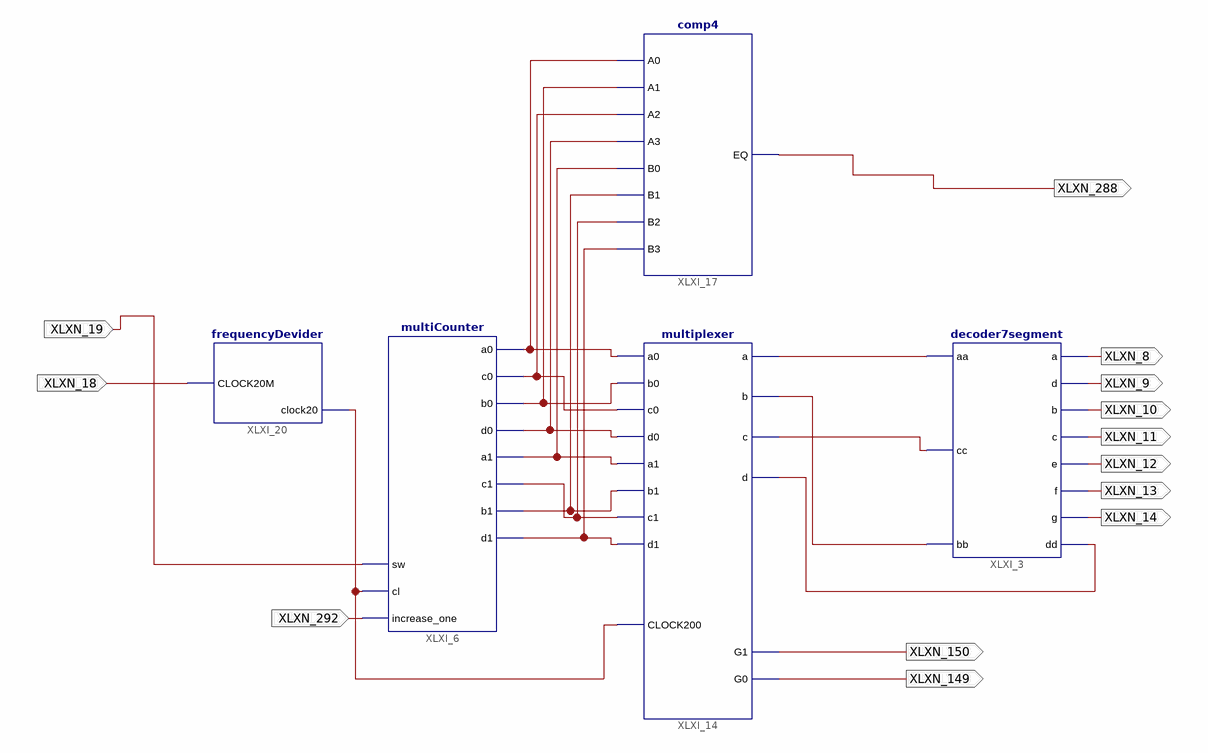
[diagram p0: schematic sheet 1]
// Xilinx ISE schematic testDividerAndCounterLED.sch (spartan6) as structural Verilog: 5 symbols, 13 ports
module testDividerAndCounterLED (
  input  XLXN_18,
  input  XLXN_19,
  input  XLXN_292,
  output XLXN_8,
  output XLXN_9,
  output XLXN_10,
  output XLXN_11,
  output XLXN_12,
  output XLXN_13,
  output XLXN_14,
  output XLXN_150,
  output XLXN_149,
  output XLXN_288
);

  wire COMMON1, XLXN_151, XLXN_152, XLXN_153, XLXN_154, XLXN_280, XLXN_281, XLXN_282, XLXN_283, XLXN_284,
       XLXN_285, XLXN_286, XLXN_287;

  decoder7segment XLXI_3 (
    .aa(XLXN_151), .cc(XLXN_153), .bb(XLXN_152), .a(XLXN_8), .d(XLXN_9), .b(XLXN_10), .c(XLXN_11),
    .e(XLXN_12), .f(XLXN_13), .g(XLXN_14), .dd(XLXN_154));
  multiplexer XLXI_14 (
    .a0(XLXN_280), .b0(XLXN_281), .c0(XLXN_282), .d0(XLXN_283), .a1(XLXN_284), .b1(XLXN_285), .c1(XLXN_286),
    .d1(XLXN_287), .CLOCK200(COMMON1), .a(XLXN_151), .b(XLXN_152), .c(XLXN_153), .d(XLXN_154), .G1(XLXN_150),
    .G0(XLXN_149));
  comp4 XLXI_17 (
    .A0(XLXN_280), .A1(XLXN_281), .A2(XLXN_282), .A3(XLXN_283), .B0(XLXN_284), .B1(XLXN_285), .B2(XLXN_286),
    .B3(XLXN_287), .EQ(XLXN_288));
  frequencyDevider XLXI_20 (.CLOCK20M(XLXN_18), .clock20(COMMON1));
  multiCounter XLXI_6 (
    .sw(XLXN_19), .cl(COMMON1), .a0(XLXN_280), .c0(XLXN_282), .b0(XLXN_281), .d0(XLXN_283), .a1(XLXN_284),
    .c1(XLXN_286), .b1(XLXN_285), .d1(XLXN_287), .increase_one(XLXN_292));
endmodule
